# Altium schematic sheet dc_dc_converter.SchDoc
size A3
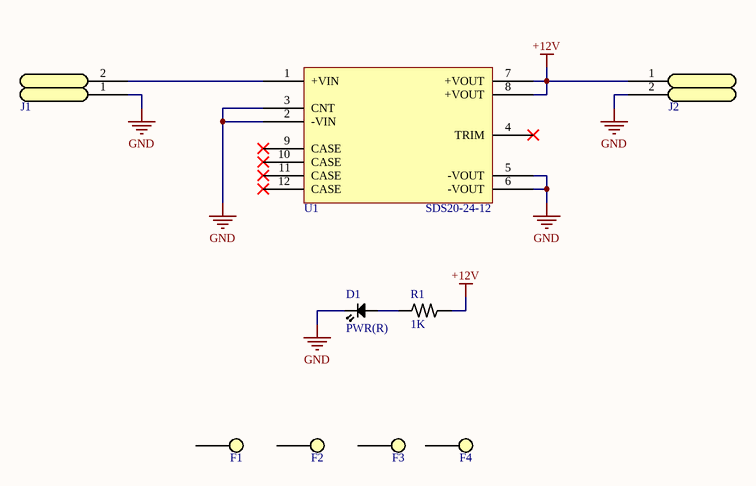
[diagram p0: dc_dc_converter.SchDoc]

## Parts
D1  value PWR(R)  [LED1608L]  (hidden comment: LED)
F1  FIXED_HOLE  [FIXED_HOLE_PAD]  (value not drawn)
F2  FIXED_HOLE  [FIXED_HOLE_PAD]  (value not drawn)
F3  FIXED_HOLE  [FIXED_HOLE_PAD]  (value not drawn)
F4  FIXED_HOLE  [FIXED_HOLE_PAD]  (value not drawn)
J1  CON2  [DG128-5.0-02P]  (value not drawn)
J2  CON2  [DG128-5.0-02P]  (value not drawn)
R1  value 1K  [RES1608L]  (hidden comment: R)
U1  SDS20-24-12  [SDS20-24-12]

## Nets
+12V: J2.1 R1.2 U1.7(+VOUT) U1.8(+VOUT)
GND: D1.1 J1.1 J2.2 U1.2(-VIN) U1.3(CNT) U1.5(-VOUT) U1.6(-VOUT)
NetD1_2: D1.2 R1.1
NetJ1_2: J1.2 U1.1(+VIN)

Not connected (* = marked no-connect by the designer): F1 1; F2 1; F3 1; F4 1; U1 4(TRIM)* 9(CASE)* 10(CASE)* 11(CASE)* 12(CASE)*

## Library data of the parts
D1 = LED: Typical LED
J1 J2 = CON2: Generic Connector 2 Pin
R1 = R: Resistor